# Altium project INNOVMED_Project.PrjPcb
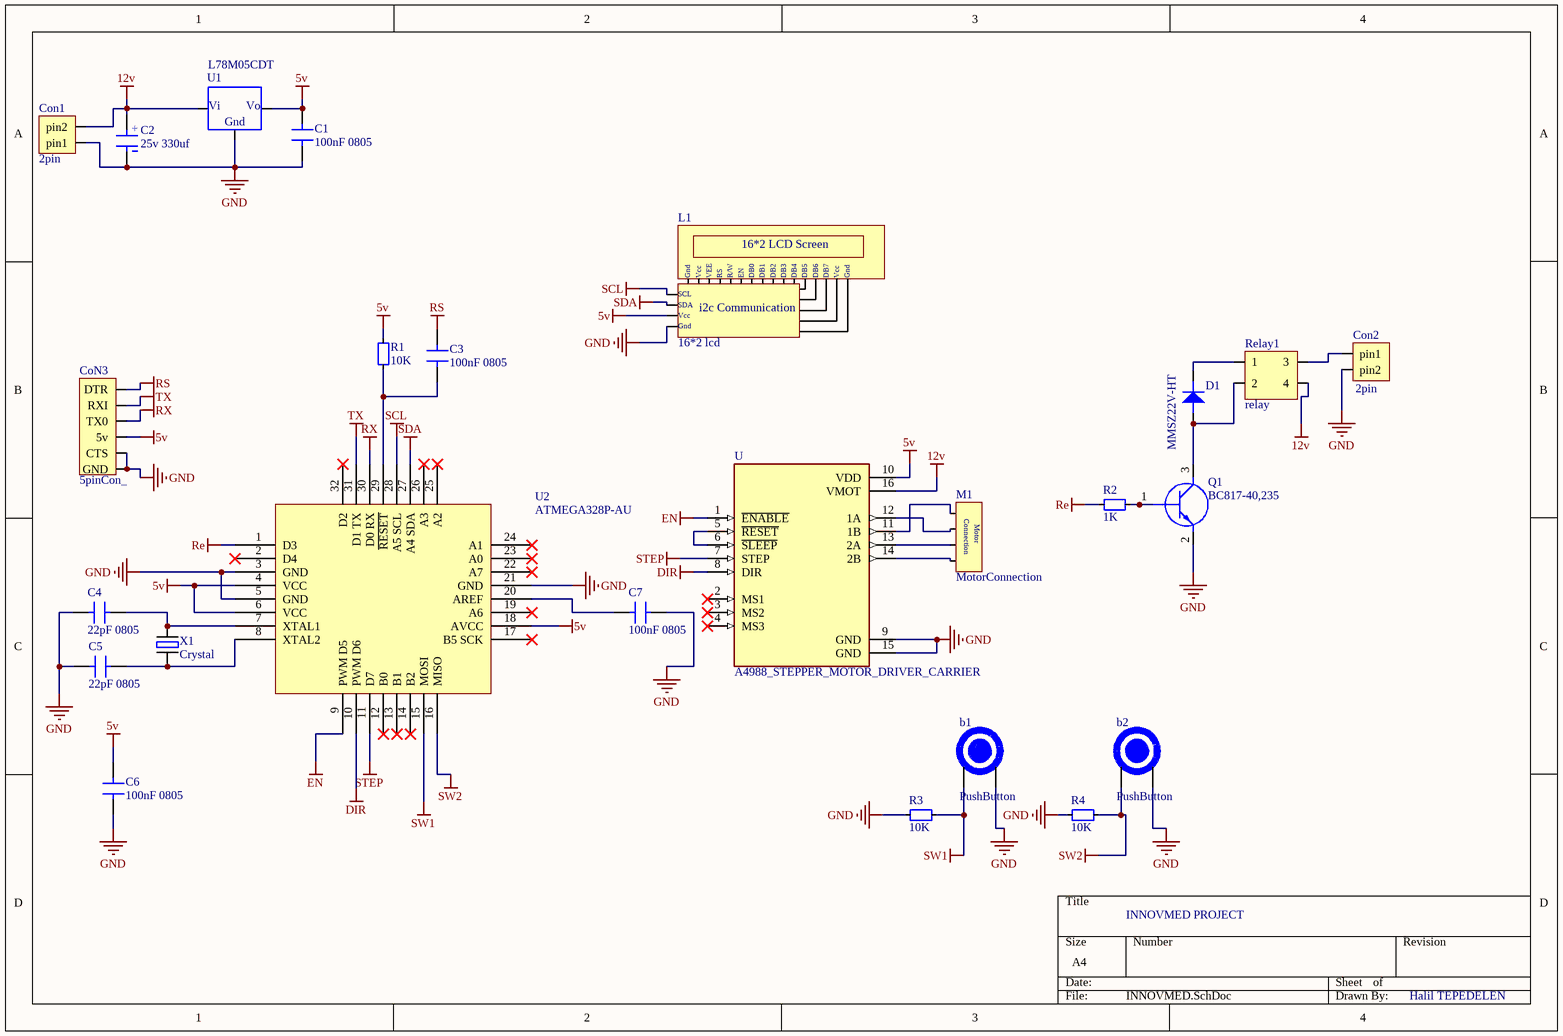
[diagram p0: INNOVMED.SchDoc]
1 sheet, 25 parts. Net scope: global (net labels, ports and power ports of the same name join across sheets).
Board file: INNOVMED.PcbDoc

## Sheet INNOVMED.SchDoc
size A4; SheetNumber: 1; SheetTotal: 1

### Parts
b1  PushButton  [2pinCon]
b2  PushButton  [2pinCon]
C1  100nF 0805  [C-0805R]
C2  25v 330uf  [10*10 capacitor]
C3  100nF 0805  [C-0805R]
C4  22pF 0805  [C-0805R]
C5  22pF 0805  [C-0805R]
C6  100nF 0805  [C-0805R]
C7  100nF 0805  [C-0805R]
Con1  2pin  [Contactor]
Con2  2pin  [Contactor]
CoN3  5pinCon_  [5pinCon]
D1  MMSZ22V-HT  [SOD123]
L1  16*2 lcd  [4pinCon]
M1  MotorConnection  [4pinCon]
Q1  BC817-40,235  [SOT95P230X110-3N]
R1  10K  [R-0805R]
R2  1K  [R-0805R]
R3  10K  [R-0805R]
R4  10K  [R-0805R]
Relay1  relay  [Relay]
U  A4988_STEPPER_MOTOR_DRIVER_CARRIER  [MODULE_A4988_STEPPER_MOTOR_DRIVER_CARRIER]
U1  L78M05CDT  [TO-252]
U2  ATMEGA328P-AU  [TQFP80P900X900X120-32N]
X1  Crystal  [crystal]

### Nets
5v: C1.1 C6.1 CoN3.4(5v) L1.3 R1.2 U.10(VDD) U1.2 U2.4(VCC) U2.6(VCC) U2.18(AVCC)
12v: C2.1 Con1.2(pin2) Relay1.4 U.16(VMOT) U1.1
DIR: U.8(DIR) U2.10(PWM_D6)
EN: U.1(~{ENABLE}) U2.9(PWM_D5)
GND: b1.2 b2.2 C1.2 C2.2 C4.2 C5.2 C6.2 C7.2 Con1.1(pin1) Con2.2(pin2) CoN3.5(CTS) CoN3.6(GND) L1.4 Q1.2(E) R3.1 R4.1 U.9(GND) U.15(GND) U1.3 U2.3(GND) U2.5(GND) U2.21(GND)
Re: R2.1 U2.1(D3)
RS: C3.1 CoN3.1(DTR)
RX: CoN3.3(TX0) U2.30(D0_RX)
SCL: L1.1 U2.28(A5_SCL)
SDA: L1.2 U2.27(A4_SDA)
STEP: U.7(STEP) U2.11(D7)
SW1: b1.1 R3.2 U2.15(MOSI)
SW2: b2.1 R4.2 U2.16(MISO)
TX: CoN3.2(RXI) U2.31(D1_TX)
NetC3_2: C3.2 R1.1 U2.29(~{RESET})
NetC4_1: C4.1 U2.7(XTAL1) X1.1
NetC5_1: C5.1 U2.8(XTAL2) X1.2
NetC7_1: C7.1 U2.20(AREF)
NetCon2_1: Con2.1(pin1) Relay1.3
NetD1_a: D1.a Q1.3(C) Relay1.2
NetD1_k: D1.k Relay1.1
NetM1_1: M1.1 U.11(1B)
NetM1_2: M1.2 U.12(1A)
NetM1_3: M1.3 U.13(2A)
NetM1_4: M1.4 U.14(2B)
NetQ1_1: Q1.1(B) R2.2
NetU_5: U.5(~{RESET}) U.6(~{SLEEP})

Not connected (* = marked no-connect by the designer): U 2(MS1)* 3(MS2)* 4(MS3)*; U2 2(D4)* 12(B0)* 13(B1)* 14(B2)* 17(B5_SCK)* 19(A6)* 22(A7)* 23(A0)* 24(A1)* 25(A2)* 26(A3)* 32(D2)*

### Notes on the sheet
- INNOVMED PROJECT
- Halil TEPEDELEN
- (in symbol 16*2 lcd) 16*2 LCD Screen; Gnd; Vcc; VEE; RS; R/W; EN; DB0; DB1; DB2; DB3; DB4; DB5; DB6; DB7; SCL; SDA; i2c Communication
- (in symbol 25v 330uf) +
- (in symbol L78M05) Vi; Vo; Gnd
- (in symbol MotorConnection) Connection; Motor

### Library data of the parts
C1 C3 C6 C7 = 100nF 0805: Manufacturer: Nichicon; Manufacturer Part Number: LKS1J472MESZ; Voltage Rating: 63V; Tolerance: 20%; Ripple Current: 3A; Life (Hours): 1000Hour; Supplier 1: Mouser; RoHS: Yes; Mount: Through Hole; Case/Package: Radial; Min Operating Temperature: -40°C; Max Operating Temperature: 85°C; Package Quantity: 250; Packaging: Bulk; Voltage Rating (DC): 63V; Termination: Snap in; Diameter: 22mm; Length: 45mm; Lead Pitch: 0.394inch; Height - Seated (Max): 1.772inch; Supplier Part Number 1: 647-LKS1J472MESZ; ComponentLink2Description: Link; ComponentLink2URL: https://ozdisan.com/Product/Detail/342152/CL21F104ZBANNNC
C4 C5 = 22pF 0805: Manufacturer: Nichicon; Manufacturer Part Number: LKS1J472MESZ; Voltage Rating: 63V; Tolerance: 20%; Ripple Current: 3A; Life (Hours): 1000Hour; Supplier 1: Mouser; RoHS: Yes; Mount: Through Hole; Case/Package: Radial; Min Operating Temperature: -40°C; Max Operating Temperature: 85°C; Package Quantity: 250; Packaging: Bulk; Voltage Rating (DC): 63V; Termination: Snap in; Diameter: 22mm; Length: 45mm; Lead Pitch: 0.394inch; Height - Seated (Max): 1.772inch; Supplier Part Number 1: 647-LKS1J472MESZ; ComponentLink1Description: Link; ComponentLink1URL: https://ozdisan.com/passive-components/capacitors/smt-smd-and-mlcc-capacitors/CL21C220JCANNNC
Q1 = BC817-40,235: Transistor BJT NPN; Manufacturer_Name: Nexperia; Datasheet Link: http://assets.nexperia.com/documents/data-sheet/BC817_BC817W_BC337.pdf; Height: 1.1mm; Manufacturer_Part_Number: BC817-40,235; Mouser Part Number: 771-BC817-40235; Mouser Price/Stock: https://www.mouser.com/Search/Refine.aspx?Keyword=771-BC817-40235; RS Part Number: 1707957; RS Price/Stock: http://uk.rs-online.com/web/p/products/1707957
R1 R3 R4 = 10K 0805
R2 = 1K 0805
U = A4988_STEPPER_MOTOR_DRIVER_CARRIER: Stepper Motor Driver; MP: A4988 STEPPER MOTOR DRIVER CARRIER; MF: Pololu; Availability: Unavailable; Price: None; Package: None; Value: *; SnapEDA_Link: https://www.snapeda.com/parts/A4988%20STEPPER%20MOTOR%20DRIVER%20CARRIER/Pololu/view-part/1499394/?ref=snap
U1 = L78M05: Manufacturer: STMicroelectronics; Manufacturer Part Number: L78M15CDT; Max Output Current: 500mA; Output Voltage: 15V; Number of Outputs: 1; Max Input Voltage: 35V; Polarity: Positive; Quiescent Current: 6mA; Output Type: Fixed; Dropout Voltage: 2V; Supplier 1: Avnet; RoHS: Yes; Mount: Surface Mount; Case/Package: DPAK; Number of Pins: 3; Min Operating Temperature: 0°C; Max Operating Temperature: 150°C; Packaging: Rail/Tube; Output Current: 500mA; Min Input Voltage: 35V; Package Quantity: 75; Length: 6.6mm; Height: 2.4mm; Width: 6.2mm; Radiation Hardening: No; Supplier Part Number 1: L78M15CDT; ComponentLink1Description: Link; ComponentLink1URL: https://ozdisan.com/integrated-circuits-ics/power-management-ics/linear-voltage-regulators/MC7805BDTRKG
U2 = ATMEGA328P-AU: Microchip Technology ATMEGA328P-AN, 8bit AVR Microcontroller, 20MHz, 32 kB Flash, 32-Pin TQFP
X1 = Crystal: AS49SD-16M-FC160F3-TR
C2 = 25v 330uf: ComponentLink1Description: Link; ComponentLink1URL: https://ozdisan.com/passive-components/capacitors/aluminum-capacitors/BXJ25VC330MJ10TP
D1 = MMSZ22V-HT: ComponentLink1Description: Link; ComponentLink1URL: https://ozdisan.com/power-semiconductors/diodes-diode-modules-and-rectifiers/zener-diodes/MMSZ22V-HT